# Altium project buoy_controller_board.PrjPcb
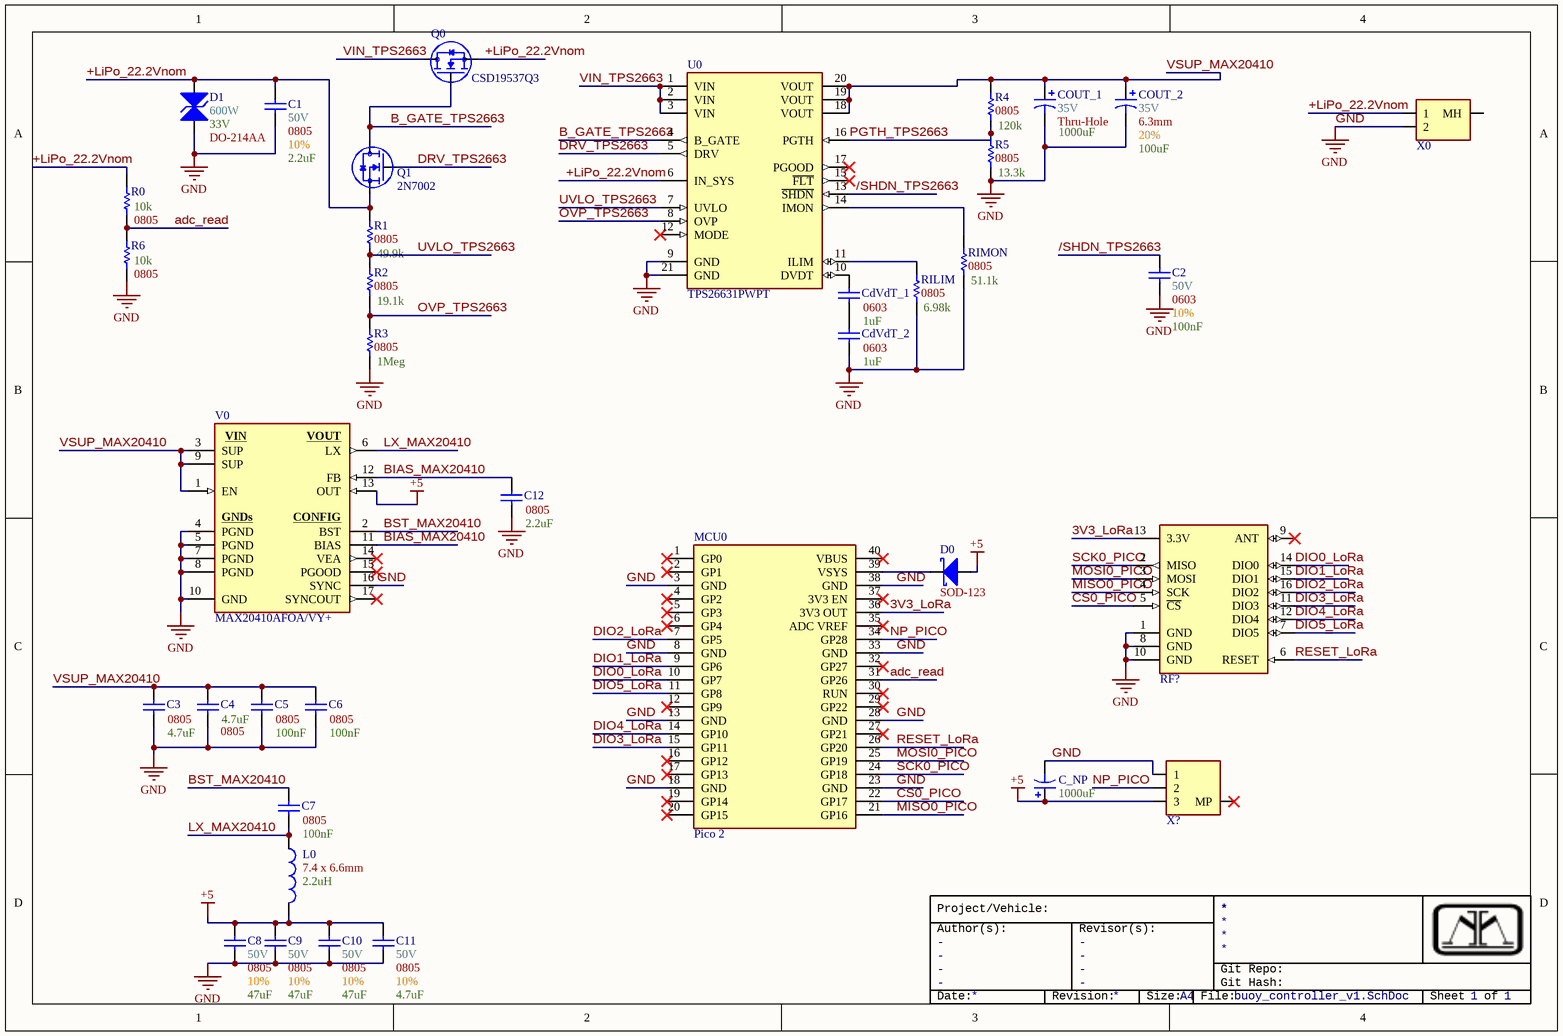
[diagram p0: buoy_controller_v1.SchDoc]
1 sheet, 37 parts. Net scope: global (net labels, ports and power ports of the same name join across sheets).
Board file: buoy_controller_v1.PcbDoc

## Sheet buoy_controller_v1.SchDoc
size A4; SheetNumber: 1; SheetTotal: 1

### Parts
C1  Max Voltage: 50V  Size Package: 0805  Tolerance: 10%  Capacitance: 2.2uF  [[Cap] SMD 0805]  (hidden comment: [Cap] 0805 2.2uF 10% 50V)
C2  Max Voltage: 50V  Size Package: 0603  Tolerance: 10%  Capacitance: 100nF  [[Cap] SMD 0603]  (hidden comment: [Cap] 0603 0.1uF 10% 50V)
C3  Size Package: 0805  Capacitance: 4.7uF  [[Cap] SMD 0805]  (hidden comment: [Cap] 0805 4.7uF 10% 50V)
C4  Size Package: 0805  Capacitance: 4.7uF  [[Cap] SMD 0805]  (hidden comment: [Cap] 0805 4.7uF 10% 50V)
C5  Size Package: 0805  Capacitance: 100nF  [[Cap] SMD 0805]  (hidden comment: [Cap] 0805 0.1uF 10% 50V)
C6  Size Package: 0805  Capacitance: 100nF  [[Cap] SMD 0805]  (hidden comment: [Cap] 0805 0.1uF 10% 50V)
C7  Size Package: 0805  Capacitance: 100nF  [[Cap] SMD 0805]  (hidden comment: [Cap] 0805 0.1uF 10% 50V)
C8  Max Voltage: 50V  Size Package: 0805  Tolerance: 10%  Capacitance: 47uF  [[Cap] SMD 0805]  (hidden comment: [Cap] 0805 4.7uF 10% 50V)
C9  Max Voltage: 50V  Size Package: 0805  Tolerance: 10%  Capacitance: 47uF  [[Cap] SMD 0805]  (hidden comment: [Cap] 0805 4.7uF 10% 50V)
C10  Max Voltage: 50V  Size Package: 0805  Tolerance: 10%  Capacitance: 47uF  [[Cap] SMD 0805]  (hidden comment: [Cap] 0805 4.7uF 10% 50V)
C11  Max Voltage: 50V  Size Package: 0805  Tolerance: 10%  Capacitance: 4.7uF  [[Cap] SMD 0805]  (hidden comment: [Cap] 0805 4.7uF 10% 50V)
C12  Size Package: 0805  Capacitance: 2.2uF  [[Cap] SMD 0805]  (hidden comment: [Cap] 0805 2.2uF 10% 50V)
C_NP  Capacitance: 1000uF  [[Cap] Thru-Hole Polarized 10mm]  (hidden comment: [Cap] Thru-Hole 1000uF 20% 35V)
CdVdT_1  Size Package: 0603  Capacitance: 1uF  [[Cap] SMD 0603]  (hidden comment: [Cap] 0603 1uF 10% 25V)
CdVdT_2  Size Package: 0603  Capacitance: 1uF  [[Cap] SMD 0603]  (hidden comment: [Cap] 0603 1uF 10% 25V)
COUT_1  Max Voltage: 35V  Size Package: Thru-Hole  Capacitance: 1000uF  [[Cap] Thru-Hole Polarized 10mm]  (hidden comment: [Cap] Thru-Hole 1000uF 20% 35V)
COUT_2  Max Voltage: 35V  Size Package: 6.3mm  Tolerance: 20%  Capacitance: 100uF  [[Cap] SMD Polarized, 6.3mm]  (hidden comment: [Cap] 6.3mm 100uF 20% 35V)
D0  Footprint: SOD-123  [[Diode] SMD SOD-123]  (hidden comment: SOD123)
D1  Wattage: 600W  Optimal Zener Voltage: 33V  [[Diode] SMD DO-214AA]  (hidden comment: DO-214AA)
L0  Package: 7.4 x 6.6mm  Inductance: 2.2uH  [[Inductor] SMD 7.4 X 6.6 X 3 MM]  (hidden comment: [2.2uH] SMD Nonstandard 10A)
MCU0  Pico 2  [[Pi] Pico 2]
Q0  CSD19537Q3  [8-VSON-CLIP]
Q1  2N7002  [SOT-23]
R0  Resistance: 10k  Size Package: 0805  [[Res] SMD 0805]  (hidden comment: [10k] SMD 0805 5% 1/8W)
R1  Size Package: 0805  Resistance: 49.9k  [[Res] SMD 0805]  (hidden comment: [52.3k] SMD 0805 1% 1/8W)
R2  Size Package: 0805  Resistance: 19.1k  [[Res] SMD 0805]  (hidden comment: [52.3k] SMD 0805 1% 1/8W)
R3  Size Package: 0805  Resistance: 1Meg  [[Res] SMD 0805]  (hidden comment: [52.3k] SMD 0805 1% 1/8W)
R4  Size Package: 0805  Resistance: 120k  [[Res] SMD 0805]  (hidden comment: [52.3k] SMD 0805 1% 1/8W)
R5  Size Package: 0805  Resistance: 13.3k  [[Res] SMD 0805]  (hidden comment: [52.3k] SMD 0805 1% 1/8W)
R6  Resistance: 10k  Size Package: 0805  [[Res] SMD 0805]  (hidden comment: [10k] SMD 0805 5% 1/8W)
RF?  [LoRa] SX1276 RFM95 Breakout  [[LoRa] SX1276 RFM95 Breakout]  (value not drawn)
RILIM  Size Package: 0805  Resistance: 6.98k  [[Res] SMD 0805]  (hidden comment: [52.3k] SMD 0805 1% 1/8W)
RIMON  Size Package: 0805  Resistance: 51.1k  [[Res] SMD 0805]  (hidden comment: [52.3k] SMD 0805 1% 1/8W)
U0  TPS26631PWPT  [[E-Fuse] 4.5-60V 6A]
V0  MAX20410AFOA/VY+  [[Switching] 17-PowerWFQFN]
X0  Anderson 2pos Right-Angle  [[Anderson] 2pos Right-Angle 1327G17]  (value not drawn)
X?  [Pheonix] 3pin 2.5mm pitch  [[Pheonix] 3pin 2.5mm pitch]  (value not drawn)

### Nets
+5: C8.2 C9.2 C10.2 C11.2 C_NP.1 D0.2(A) L0.2 V0.13(OUT) X?.3
GND: C1.1 C2.2 C3.1 C4.1 C5.1 C6.1 C8.1 C9.1 C10.1 C11.1 C12.1 C_NP.2 CdVdT_2.1 COUT_1.2 COUT_2.2 D1.2(K) MCU0.3(GND) MCU0.8(GND) MCU0.13(GND) MCU0.18(GND) MCU0.23(GND) MCU0.28(GND) MCU0.33(GND) MCU0.38(GND) R3.1 R5.1 R6.1 RF?.1(GND) RF?.8(GND) RF?.10(GND) RILIM.1 RIMON.1 U0.9(GND) U0.21(GND) V0.4(PGND) V0.5(PGND) V0.7(PGND) V0.8(PGND) V0.10(GND) V0.16(SYNC) X0.2 X?.1
3V3_LoRa: MCU0.36(3V3_OUT) RF?.13(3.3V)
+LiPo_22.2Vnom: C1.2 D1.1(A) Q0.2(Source) Q1.2(Source) R0.2 R1.2 U0.6(IN_SYS) X0.1
/SHDN_TPS2663: C2.1 U0.13(~{SHDN})
adc_read: MCU0.31(GP26) R0.1 R6.2
B_GATE_TPS2663: Q0.1(Gate) Q1.3(Drain) U0.4(B_GATE)
BIAS_MAX20410: C12.2 V0.11(BIAS) V0.12(FB)
BST_MAX20410: C7.2 V0.2(BST)
CS0_PICO: MCU0.22(GP17) RF?.5(~{CS})
DIO0_LoRa: MCU0.10(GP7) RF?.14(DIO0)
DIO1_LoRa: MCU0.9(GP6) RF?.15(DIO1)
DIO2_LoRa: MCU0.7(GP5) RF?.16(DIO2)
DIO3_LoRa: MCU0.15(GP11) RF?.11(DIO3)
DIO4_LoRa: MCU0.14(GP10) RF?.12(DIO4)
DIO5_LoRa: MCU0.11(GP8) RF?.7(DIO5)
DRV_TPS2663: Q1.1(Gate) U0.5(DRV)
LX_MAX20410: C7.1 L0.1 V0.6(LX)
MISO0_PICO: MCU0.21(GP16) RF?.4(SCK)
MOSI0_PICO: MCU0.25(GP19) RF?.3(MOSI)
NP_PICO: MCU0.34(GP28) X?.2
OVP_TPS2663: R2.1 R3.2 U0.8(OVP)
PGTH_TPS2663: R4.1 R5.2 U0.16(PGTH)
RESET_LoRa: MCU0.26(GP20) RF?.6(RESET)
SCK0_PICO: MCU0.24(GP18) RF?.2(MISO)
UVLO_TPS2663: R1.1 R2.2 U0.7(UVLO)
VIN_TPS2663: Q0.3(Drain) U0.1(VIN) U0.2(VIN) U0.3(VIN)
VSUP_MAX20410: C3.2 C4.2 C5.2 C6.2 COUT_1.1 COUT_2.1 R4.2 U0.18(VOUT) U0.19(VOUT) U0.20(VOUT) V0.1(EN) V0.3(SUP) V0.9(SUP)
NetCdVdT_1_1: CdVdT_1.1 CdVdT_2.2
NetCdVdT_1_2: CdVdT_1.2 U0.10(DVDT)
NetD0_1: D0.1(K) MCU0.39(VSYS)
NetRILIM_2: RILIM.2 U0.11(ILIM)
NetRIMON_2: RIMON.2 U0.14(IMON)

Not connected (* = marked no-connect by the designer): MCU0 1(GP0)* 2(GP1)* 4(GP2)* 5(GP3)* 6(GP4)* 12(GP9)* 16(GP12)* 17(GP13)* 19(GP14)* 20(GP15)* 27(GP21)* 29(GP22)* 30(RUN)* 32(GP27)* 35(ADC_VREF)* 37(3V3_EN)* 40(VBUS)*; RF? 9(ANT)*; U0 12(MODE)* 15(~{FLT})* 17(PGOOD)*; V0 14(VEA)* 15(PGOOD)* 17(SYNCOUT)*; X0 MH; X? MP*

### Notes on the sheet
- Project/Vehicle:
- Author(s):
- -
- Revisor(s):
- Git Repo:
- Git Hash:
- Date:
- Revision:
- Size:
- A4
- File:
- Sheet
- of
- (in symbol [Switching] SMD 0.8-10V 10A) VIN; VOUT; GNDs; CONFIG

### Library data of the parts
C1 C12 = [Cap] 0805 2.2uF 10% 50V: UMK212BB7225KG-T; Supplier 1: DigiKey; Supplier Part Number 1: 587-3169-1-ND
  C12: Max Voltage: 50V; Tolerance: 10%
C2 = [Cap] 0603 0.1uF 10% 50V: CL10B104KB8NNNC; Supplier 1: DigiKey; Supplier Part Number 1: 1276-1000-6-ND
C3 C4 C8-C11 = [Cap] 0805 4.7uF 10% 50V: GRT21BR61H475KE13L; Supplier 1: DigiKey; Supplier Part Number 1: 490-12394-1-ND
  C3 C4: Max Voltage: 50V; Tolerance: 10%
C5-C7 = [Cap] 0805 0.1uF 10% 50V: CL21B104KBCNNNC; Supplier 1: DigiKey; Supplier Part Number 1: 1276-1003-6-ND; Max Voltage: 50V; Tolerance: 10%
C_NP COUT_1 = [Cap] Thru-Hole 1000uF 20% 35V: 35PK1000MEFC10X20; Supplier 1: DigiKey; Supplier Part Number 1: 1189-1742-ND; Tolerance: 20%
  C_NP: Max Voltage: 35V; Size Package: Thru-Hole
CdVdT_1 CdVdT_2 = [Cap] 0603 1uF 10% 25V: CL10B105KA8NNNC; Supplier 1: DigiKey; Supplier Part Number 1: 1276-1184-1-ND; Max Voltage: 25V; Tolerance: 10%
COUT_2 = [Cap] 6.3mm 100uF 20% 35V: EEE-FT1V101AP; Supplier 1: DigiKey; Supplier Part Number 1: PCE5016DKR-ND
D0 = [Schottky] SMD 40V 1A: B5819W-TP; Supplier 1: DigiKey; Supplier Part Number 1: B5819W-TPMSCT-ND
D1 = [TVS] SMBJ33CA: SMBJ33CA; Supplier 1: DigiKey; Supplier Part Number 1: SMBJ33CA-FDICT-ND; Footprint: DO-214AA
L0 = [2.2uH] SMD Nonstandard 10A: ECS-MPIL0630-2R2MC; Supplier 1: DigiKey; Supplier Part Number 1: XC2402CT-ND
MCU0 = [Pi] Pico 2: SC1631; Supplier 1: DigiKey; Supplier Part Number 1: 2648-SC1631TR-ND
Q0 = [NMOS] SMD 100V 50A 14.5mOhm: Supplier 1: DigiKey; Supplier Part Number 1: 296-44351-6-ND
Q1 = [NMOS] SMD 60V 115mA 7.5Ohm: IDS_Max: 115mA; VDS_Max: 60V; Supplier 1: DigiKey; Supplier Part Number 1: 2N7002NDKR-ND; Package: SOT-23-3
R0 R6 = [10k] SMD 0805 5% 1/8W: RC0603FR-0710KL; Wattage: 1/10W; Supplier 1: DigiKey; Supplier Part Number 1: 311-10.0KHRDKR-ND; Tolerance: 5%
R1-R5 RILIM RIMON = [52.3k] SMD 0805 1% 1/8W: RC0805FR-0752K3L; Supplier 1: DigiKey; Supplier Part Number 1: 311-52.3KCRCT-ND; Wattage: 1/8W; Tolerance: 1%
U0 = [E-Fuse] 4.5-60V 6A
V0 = [Switching] SMD 0.8-10V 10A: Supplier 1: DigiKey; Supplier Part Number 1: 505-MAX20410AFOA/VY+-ND
X0 = [Anderson] 2pos Right-Angle
X? = [Pheonix] 3pin 2.5mm pitch: 1778777; Supplier 1: DigiKey; Supplier Part Number 1: 277-2316-1-ND
RF? = [LoRa] SX1276 RFM95 Breakout: ComponentLink1Description: Amazon Link; ComponentLink1URL: https://www.amazon.com/Lubeby-Smart-Original-915Mhz-Transceiver/dp/B0BHLK9FC9; ComponentLink2Description: Makerfabs Link; ComponentLink2URL: https://www.makerfabs.com/sx1276-lora-module-915mhz-rfm95.html